# Altium schematic sheet CPU-board-Sheet2-multi-rev.0.1.SchDoc: SMART METER Main Board
size A3; SheetNumber: 2
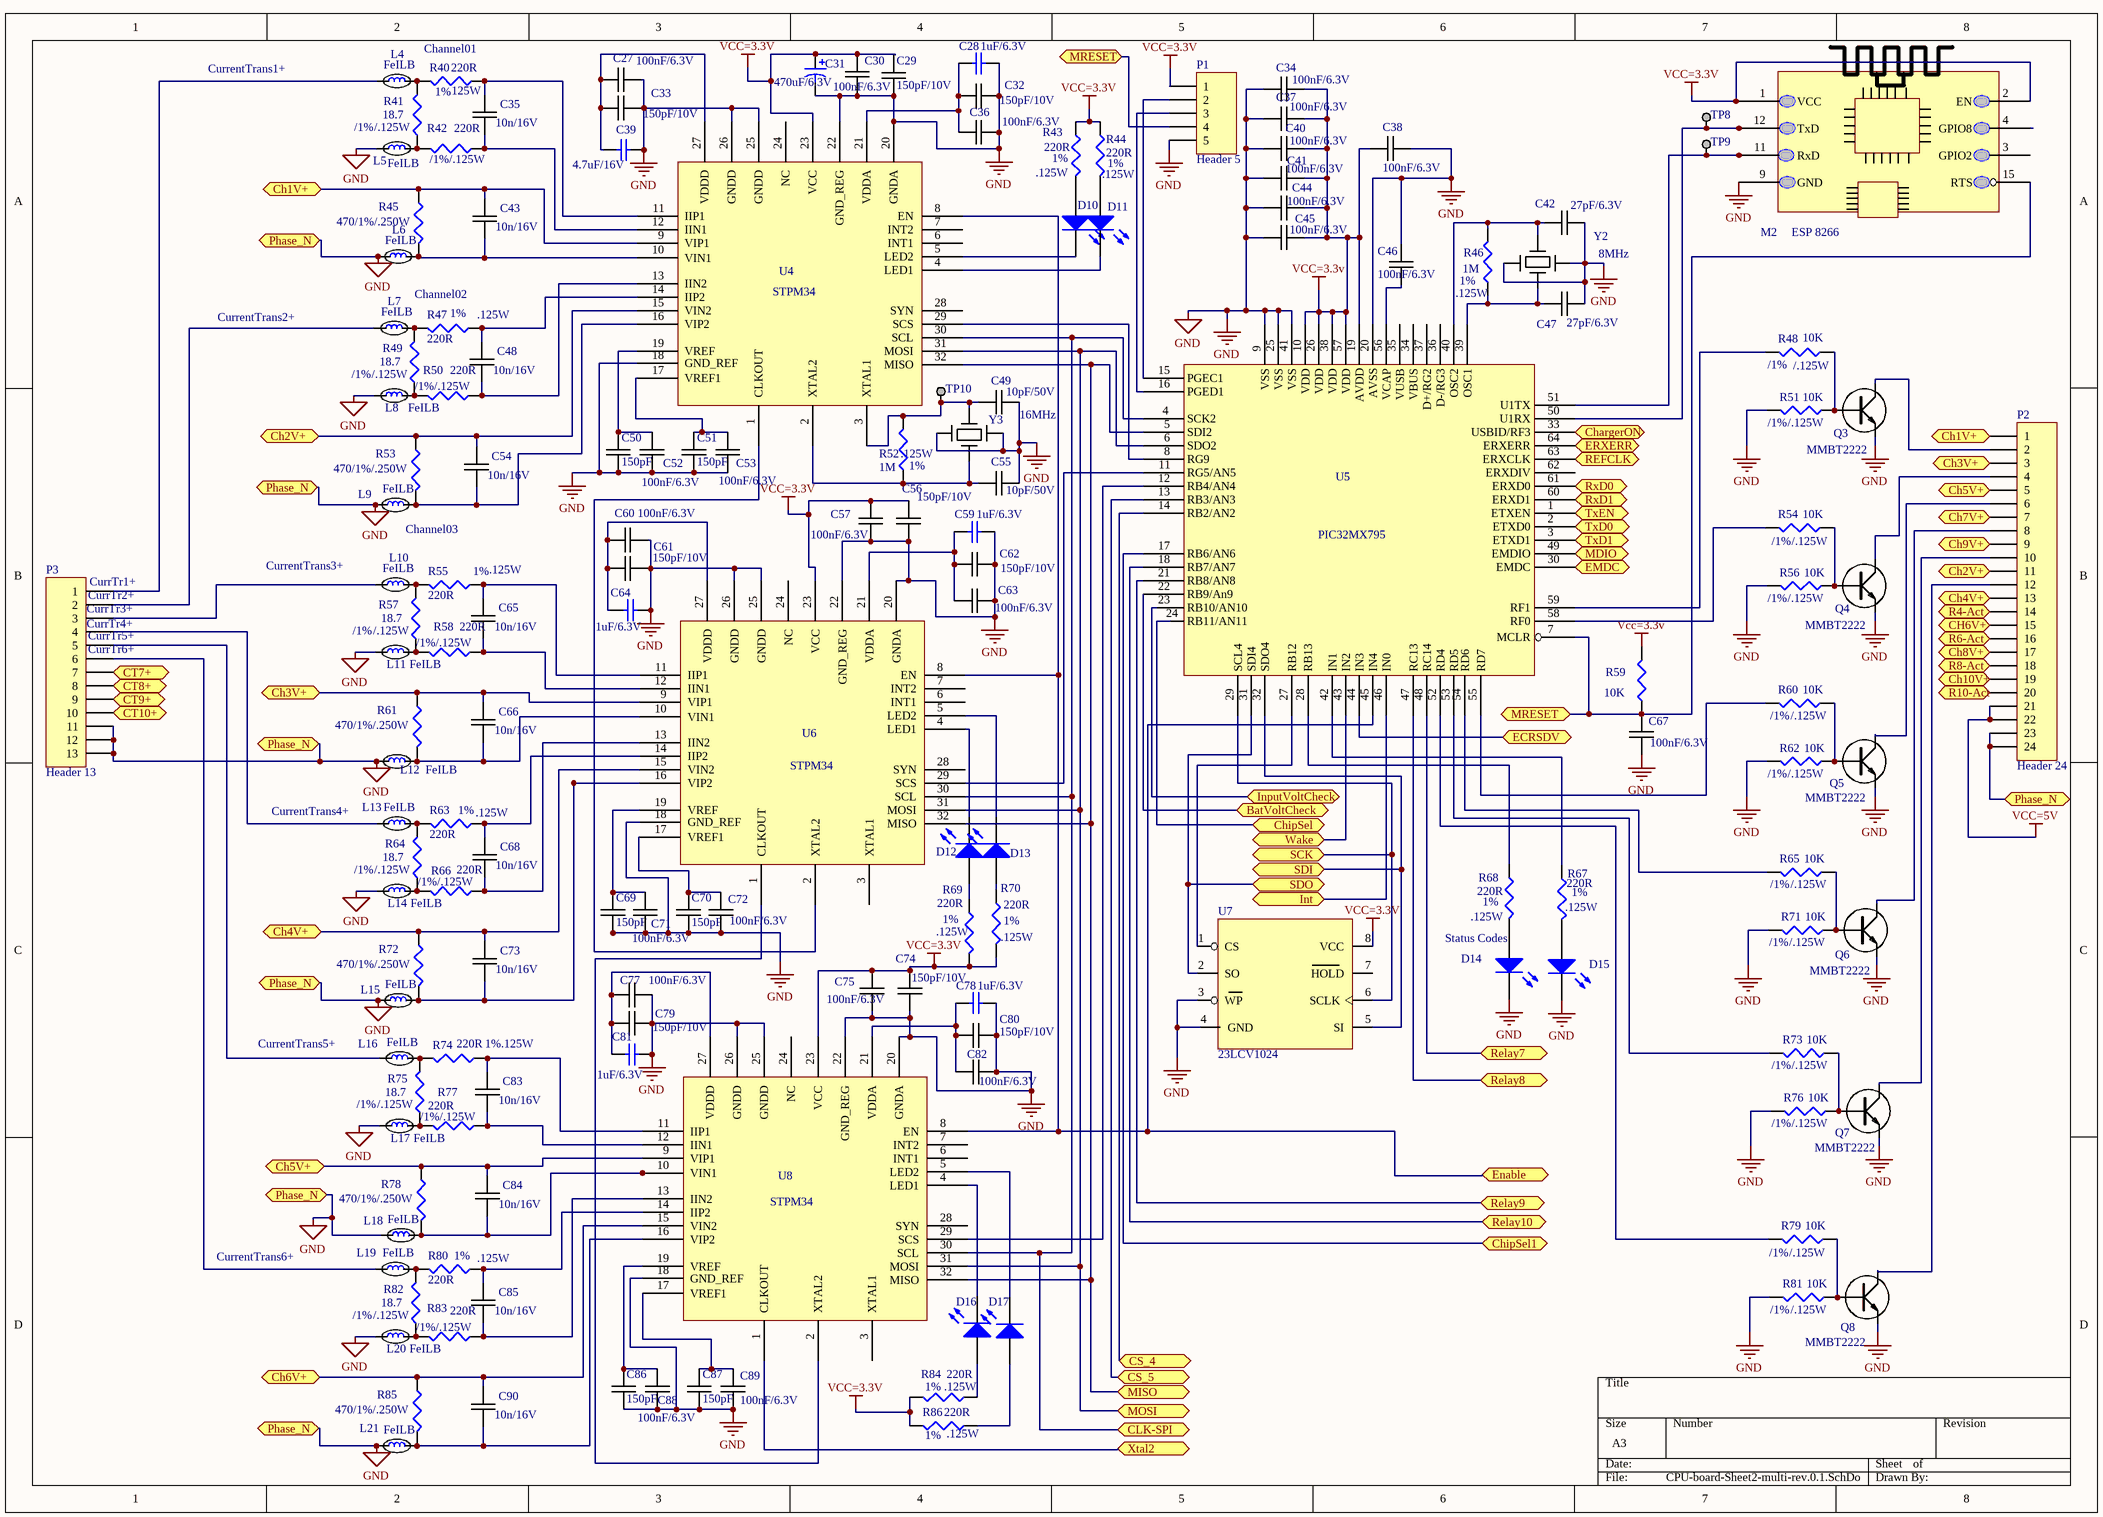
[diagram p0: CPU-board-Sheet2-multi-rev.0.1.SchDoc]

## Parts
C27  100nF/6.3V  [0402C-GENERIC]
C28  1uF/6.3V  [0402C-GENERIC]
C29  150pF/10V  [0402C-GENERIC]
C30  100nF/6.3V  [0402C-GENERIC]
C31  470uF/6.3V  [470uF/6.3v]
C32  150pF/10V  [0402C-GENERIC]
C33  150pF/10V  [0402C-GENERIC]
C34  100nF/6.3V  [0402C-GENERIC]
C35  10n/16V  [0402C-GENERIC]
C36  100nF/6.3V  [0402C-GENERIC]
C37  100nF/6.3V  [0402C-GENERIC]
C38  100nF/6.3V  [0402C-GENERIC]
C39  4.7uF/16V  [0402C-GENERIC]
C40  100nF/6.3V  [0402C-GENERIC]
C41  100nF/6.3V  [0402C-GENERIC]
C42  27pF/6.3V  [0402C-GENERIC]
C43  10n/16V  [0402C-GENERIC]
C44  100nF/6.3V  [0402C-GENERIC]
C45  100nF/6.3V  [0402C-GENERIC]
C46  100nF/6.3V  [0402C-GENERIC]
C47  27pF/6.3V  [0402C-GENERIC]
C48  10n/16V  [0402C-GENERIC]
C49  10pF/50V  [0402C-GENERIC]
C50  150pF  [0402C-GENERIC]
C51  150pF  [0402C-GENERIC]
C52  100nF/6.3V  [0402C-GENERIC]
C53  100nF/6.3V  [0402C-GENERIC]
C54  10n/16V  [0402C-GENERIC]
C55  10pF/50V  [0402C-GENERIC]
C56  150pF/10V  [0402C-GENERIC]
C57  100nF/6.3V  [0402C-GENERIC]
C59  1uF/6.3V  [0402C-GENERIC]
C60  100nF/6.3V  [0402C-GENERIC]
C61  150pF/10V  [0402C-GENERIC]
C62  150pF/10V  [0402C-GENERIC]
C63  100nF/6.3V  [0402C-GENERIC]
C64  1uF/6.3V  [0402C-GENERIC]
C65  10n/16V  [0402C-GENERIC]
C66  10n/16V  [0402C-GENERIC]
C67  100nF/6.3V  [0402C-GENERIC]
C68  10n/16V  [0402C-GENERIC]
C69  150pF  [0402C-GENERIC]
C70  150pF  [0402C-GENERIC]
C71  100nF/6.3V  [0402C-GENERIC]
C72  100nF/6.3V  [0402C-GENERIC]
C73  10n/16V  [0402C-GENERIC]
C74  150pF/10V  [0402C-GENERIC]
C75  100nF/6.3V  [0402C-GENERIC]
C77  100nF/6.3V  [0402C-GENERIC]
C78  1uF/6.3V  [0402C-GENERIC]
C79  150pF/10V  [0402C-GENERIC]
C80  150pF/10V  [0402C-GENERIC]
C81  1uF/6.3V  [0402C-GENERIC]
C82  100nF/6.3V  [0402C-GENERIC]
C83  10n/16V  [0402C-GENERIC]
C84  10n/16V  [0402C-GENERIC]
C85  10n/16V  [0402C-GENERIC]
C86  150pF  [0402C-GENERIC]
C87  150pF  [0402C-GENERIC]
C88  100nF/6.3V  [0402C-GENERIC]
C89  100nF/6.3V  [0402C-GENERIC]
C90  10n/16V  [0402C-GENERIC]
D10  LED2  [LED-SM]  (value not drawn)
D11  LED2  [LED-SM]  (value not drawn)
D12  LED2  [LED-SM]  (value not drawn)
D13  LED2  [LED-SM]  (value not drawn)
D14  LED2  [LED-SM]  (value not drawn)
D15  LED2  [LED-SM]  (value not drawn)
D16  LED2  [LED-SM]  (value not drawn)
D17  LED2  [LED-SM]  (value not drawn)
L4  FeILB  [0603C-TBD]
L5  FeILB  [0603C-TBD]
L6  FeILB  [0603C-TBD]
L7  FeILB  [0603C-TBD]
L8  FeILB  [0603C-TBD]
L9  FeILB  [0603C-TBD]
L10  FeILB  [0603C-TBD]
L11  FeILB  [0603C-TBD]
L12  FeILB  [0603C-TBD]
L13  FeILB  [0603C-TBD]
L14  FeILB  [0603C-TBD]
L15  FeILB  [0603C-TBD]
L16  FeILB  [0603C-TBD]
L17  FeILB  [0603C-TBD]
L18  FeILB  [0603C-TBD]
L19  FeILB  [0603C-TBD]
L20  FeILB  [0603C-TBD]
L21  FeILB  [0603C-TBD]
M2  ESP 8266  [PCBComponent_1 - duplicate]
P1  Header 5  [HDR1X5]
P2  Header 24  [HDR1X24]
P3  Header 13  [HDR1X13]
Q3  MMBT2222  [MMBT2222]
Q4  MMBT2222  [MMBT2222]
Q5  MMBT2222  [MMBT2222]
Q6  MMBT2222  [MMBT2222]
Q7  MMBT2222  [MMBT2222]
Q8  MMBT2222  [MMBT2222]
R40  220R  [0402R-TBD]
R41  18.7  [0402R-TBD]
R42  220R  [0402R-TBD]
R43  220R  [0402R-TBD]
R44  220R  [0402R-TBD]
R45  470/1%/.250W  [1206FB-GENERIC]
R46  1M  [0402R-TBD]
R47  220R  [0402R-TBD]
R48  10K  [0402R-TBD]
R49  18.7  [0402R-TBD]
R50  220R  [0402R-TBD]
R51  10K  [0402R-TBD]
R52  1M  [0402R-TBD]
R53  470/1%/.250W  [1206FB-GENERIC]
R54  10K  [0402R-TBD]
R55  220R  [0402R-TBD]
R56  10K  [0402R-TBD]
R57  18.7  [0402R-TBD]
R58  220R  [0402R-TBD]
R59  10K  [0402R-TBD]
R60  10K  [0402R-TBD]
R61  470/1%/.250W  [1206FB-GENERIC]
R62  10K  [0402R-TBD]
R63  220R  [0402R-TBD]
R64  18.7  [0402R-TBD]
R65  10K  [0402R-TBD]
R66  220R  [0402R-TBD]
R67  220R  [0402R-TBD]
R68  220R  [0402R-TBD]
R69  220R  [0402R-TBD]
R70  220R  [0402R-TBD]
R71  10K  [0402R-TBD]
R72  470/1%/.250W  [1206FB-GENERIC]
R73  10K  [0402R-TBD]
R74  220R  [0402R-TBD]
R75  18.7  [0402R-TBD]
R76  10K  [0402R-TBD]
R77  220R  [0402R-TBD]
R78  470/1%/.250W  [1206FB-GENERIC]
R79  10K  [0402R-TBD]
R80  220R  [0402R-TBD]
R81  10K  [0402R-TBD]
R82  18.7  [0402R-TBD]
R83  220R  [0402R-TBD]
R84  220R  [0402R-TBD]
R85  470/1%/.250W  [1206FB-GENERIC]
R86  220R  [0402R-TBD]
TP8  TESTPOINT  [TESTPOINT]  (value not drawn)
TP9  TESTPOINT  [TESTPOINT]  (value not drawn)
TP10  TESTPOINT  [TESTPOINT]  (value not drawn)
U4  STPM34  [QFN32_L]
U5  PIC32MX795  [TQFP-PT64_N]
U6  STPM34  [QFN32_L]
U7  23LCV1024  [SO8_L]
U8  STPM34  [QFN32_L]
Y2  8MHz  [CeramicResonator8-16MHZ]
Y3  16MHz  [CeramicResonator8-16MHZ]

## Ports
BatVoltCheck, Ch1V+, Ch2V+, Ch3V+, Ch4V+, Ch5V+, Ch6V+, CH6V+, Ch7V+, Ch8V+, Ch9V+, Ch10V+, ChargerON, ChipSel, ChipSel1, CLK-SPI, CS_4, CS_5, CT7+, CT8+, CT9+, CT10+, ECRSDV, EMDC, Enable, ERXERR, InputVoltCheck, Int, MDIO, MISO, MOSI, MRESET, Phase_N, R4-Act, R6-Act, R8-Act, R10-Act, REFCLK, Relay7, Relay8, Relay9, Relay10, RxD0, RxD1, SCK, SDI, SDO, TxD0, TxD1, TxEN, Wake, Xtal2

## Nets
GND: C27.2 C28.2 C29.2 C30.2 C31.2 C32.2 C33.2 C34.1 C36.2 C37.1 C38.2 C39.2 C40.1 C41.1 C42.2 C44.1 C45.1 C46.2 C47.2 C49.2 C50.2 C51.2 C52.1 C53.2 C55.2 C56.2 C57.2 C59.2 C60.2 C61.2 C62.2 C63.2 C64.2 C67.2 C69.2 C70.2 C71.2 C72.2 C74.2 C75.2 C77.2 C78.2 C79.2 C80.2 C81.2 C82.2 C86.2 C87.2 C88.2 C89.2 D14.2(K) D15.2(K) L5.1 L6.1 L8.1 L9.1 L11.1 L12.1 L14.1 L15.1 L17.1 L18.1 L20.1 L21.1 M2.9(GND) P1.5 P2.23 P2.24 P3.11 P3.12 P3.13 Q3.E Q4.E Q5.E Q6.E Q7.E Q8.E R51.2 R56.2 R62.2 R71.2 R76.2 R81.2 U4.18(GND_REF) U4.20(GNDA) U4.22(GND_REG) U4.25(GNDD) U4.26(GNDD) U5.9(VSS) U5.20(AVSS) U5.25(VSS) U5.41(VSS) U6.18(GND_REF) U6.20(GNDA) U6.22(GND_REG) U6.25(GNDD) U6.26(GNDD) U7.3(WP) U7.4(GND) U8.18(GND_REF) U8.20(GNDA) U8.22(GND_REG) U8.25(GNDD) U8.26(GNDD) Y2.2 Y2.4 Y3.2 Y3.4 ; port Phase_N
VCC=3.3V: C30.1 C31.1 C34.2 C37.2 C38.1 C40.2 C41.2 C44.2 C45.2 C56.1 C57.1 C74.1 C75.1 M2.1(VCC) M2.2(EN) P1.1 R43.1 R44.1 R59.2 R69.2 R70.2 R84.2 R86.2 U4.23(VCC) U5.10(VDD) U5.19(AVDD) U5.26(VDD) U5.38(VDD) U5.57(VDD) U6.23(VCC) U7.8(VCC) U8.23(VCC)
VCC=5V: P2.21 P2.22
BatVoltCheck: U5.22(RB9/An9) ; port BatVoltCheck
Ch1V+: C43.2 P2.1 R45.1 U4.9(VIP1) ; port Ch1V+
Ch2V+: C54.2 P2.11 R53.1 U4.15(VIN2) ; port Ch2V+
Ch3V+: C66.2 P2.3 R61.1 U6.9(VIP1) ; port Ch3V+
Ch4V+: C73.2 P2.13 R72.1 U6.15(VIN2) ; port Ch4V+
Ch5V+: C84.2 P2.5 R78.1 U8.9(VIP1) ; port Ch5V+
Ch6V+: C90.2 P2.15 R85.1 U8.15(VIN2) ; port Ch6V+, port CH6V+
Ch7V+: P2.7 ; port Ch7V+
Ch8V+: P2.17 ; port Ch8V+
Ch9V+: P2.9 ; port Ch9V+
Ch10V+: P2.19 ; port Ch10V+
ChargerON: U5.33(USBID/RF3) ; port ChargerON
ChipSel: U5.24(RB11/AN11) ; port ChipSel
ChipSel1: U5.17(RB6/AN6) ; port ChipSel1
CLK-SPI: U4.30(SCL) U5.4(SCK2) U6.30(SCL) U8.30(SCL) ; port CLK-SPI
CS_4: U5.14(RB2/AN2) ; port CS_4
CS_5: U5.13(RB3/AN3) ; port CS_5
CT7+: P3.7 ; port CT7+
CT8+: P3.8 ; port CT8+
CT9+: P3.9 ; port CT9+
CT10+: P3.10 ; port CT10+
ECRSDV: U5.44(IN3) ; port ECRSDV
EMDC: U5.30(EMDC) ; port EMDC
Enable: U4.8(EN) U5.45(IN4) U6.8(EN) U8.8(EN) ; port Enable
ERXERR: U5.64(ERXERR) ; port ERXERR
InputVoltCheck: U5.23(RB10/AN10) ; port InputVoltCheck
Int: U5.46(IN0) ; port Int
MDIO: U5.49(EMDIO) ; port MDIO
MISO: U4.32(MISO) U5.5(SDI2) U6.32(MISO) U8.32(MISO) ; port MISO
MOSI: U4.31(MOSI) U5.6(SDO2) U6.31(MOSI) U8.31(MOSI) ; port MOSI
MRESET: C67.1 M2.15(RTS) P1.4 R59.1 U5.7(MCLR) ; port MRESET
R4-Act: P2.14 ; port R4-Act
R6-Act: P2.16 ; port R6-Act
R8-Act: P2.18 ; port R8-Act
R10-Act: P2.20 ; port R10-Act
REFCLK: U5.63(ERXCLK) ; port REFCLK
Relay7: U5.48(RC14) ; port Relay7
Relay8: U5.47(RC13) ; port Relay8
Relay9: U5.21(RB8/AN8) ; port Relay9
Relay10: U5.18(RB7/AN7) ; port Relay10
RxD0: U5.61(ERXD0) ; port RxD0
RxD1: U5.60(ERXD1) ; port RxD1
SCK: U5.29(SCL4) U7.6(SCLK) ; port SCK
SDI: U5.32(SDO4) U7.5(SI) ; port SDI
SDO: U5.31(SDI4) U7.2(SO) ; port SDO
TxD0: U5.2(ETXD0) ; port TxD0
TxD1: U5.3(ETXD1) ; port TxD1
TxEN: U5.1(ETXEN) ; port TxEN
Wake: U5.43(IN2) ; port Wake
Xtal2: U8.1(CLKOUT) ; port Xtal2
NetC27_1: C27.1 C33.1 C39.1 U4.27(VDDD)
NetC28_1: C28.1 C32.1 C36.1 U4.21(VDDA)
NetC35_1: C35.1 R42.1 U4.12(IIN1)
NetC35_2: C35.2 R40.1 U4.11(IIP1)
NetC42_1: C42.1 R46.2 U5.40(OSC2) Y2.1
NetC43_1: C43.1 L6.2 R45.2 U4.10(VIN1)
NetC46_1: C46.1 U5.56(VCAP)
NetC47_1: C47.1 R46.1 U5.39(OSC1) Y2.3
NetC48_1: C48.1 R50.1 U4.13(IIN2)
NetC48_2: C48.2 R47.1 U4.14(IIP2)
NetC49_1: C49.1 R52.2 TP10.1 U4.3(XTAL1) Y3.3
NetC50_1: C50.1 C52.2 U4.19(VREF)
NetC51_1: C51.1 C53.1 U4.17(VREF1)
NetC54_1: C54.1 L9.2 R53.2 U4.16(VIP2)
NetC55_1: C55.1 R52.1 U4.2(XTAL2) Y3.1
NetC59_1: C59.1 C62.1 C63.1 U6.21(VDDA)
NetC60_1: C60.1 C61.1 C64.1 U6.27(VDDD)
NetC65_1: C65.1 R58.1 U6.12(IIN1)
NetC65_2: C65.2 R55.1 U6.11(IIP1)
NetC66_1: C66.1 L12.2 R61.2 U6.10(VIN1)
NetC68_1: C68.1 R66.1 U6.13(IIN2)
NetC68_2: C68.2 R63.1 U6.14(IIP2)
NetC69_1: C69.1 C71.1 U6.19(VREF)
NetC70_1: C70.1 C72.1 U6.17(VREF1)
NetC73_1: C73.1 L15.2 R72.2 U6.16(VIP2)
NetC77_1: C77.1 C79.1 C81.1 U8.27(VDDD)
NetC78_1: C78.1 C80.1 C82.1 U8.21(VDDA)
NetC83_1: C83.1 R77.1 U8.12(IIN1)
NetC83_2: C83.2 R74.1 U8.11(IIP1)
NetC84_1: C84.1 L18.2 R78.2 U8.10(VIN1)
NetC85_1: C85.1 R83.1 U8.13(IIN2)
NetC85_2: C85.2 R80.1 U8.14(IIP2)
NetC86_1: C86.1 C88.1 U8.19(VREF)
NetC87_1: C87.1 C89.1 U8.17(VREF1)
NetC90_1: C90.1 L21.2 R85.2 U8.16(VIP2)
NetD10_1: D10.1(A) R43.2
NetD10_2: D10.2(K) U4.5(LED2)
NetD11_1: D11.1(A) R44.2
NetD11_2: D11.2(K) U4.4(LED1)
NetD12_1: D12.1(A) R69.1
NetD12_2: D12.2(K) U6.4(LED1)
NetD13_1: D13.1(A) R70.1
NetD13_2: D13.2(K) U6.5(LED2)
NetD14_1: D14.1(A) R68.2
NetD15_1: D15.1(A) R67.2
NetD16_1: D16.1(A) R84.1
NetD16_2: D16.2(K) U8.4(LED1)
NetD17_1: D17.1(A) R86.1
NetD17_2: D17.2(K) U8.5(LED2)
NetL4_1: L4.1 P3.1
NetL4_2: L4.2 R40.2 R41.2
NetL5_2: L5.2 R41.1 R42.2
NetL7_1: L7.1 P3.2
NetL7_2: L7.2 R47.2 R49.2
NetL8_2: L8.2 R49.1 R50.2
NetL10_1: L10.1 P3.3
NetL10_2: L10.2 R55.2 R57.2
NetL11_2: L11.2 R57.1 R58.2
NetL13_1: L13.1 P3.4
NetL13_2: L13.2 R63.2 R64.2
NetL14_2: L14.2 R64.1 R66.2
NetL16_1: L16.1 P3.5
NetL16_2: L16.2 R74.2 R75.2
NetL17_2: L17.2 R75.1 R77.2
NetL19_1: L19.1 P3.6
NetL19_2: L19.2 R80.2 R82.2
NetL20_2: L20.2 R82.1 R83.2
NetM2_11: M2.11(RxD) TP9.1 U5.51(U1TX)
NetM2_12: M2.12(TxD) TP8.1 U5.50(U1RX)
NetP1_2: P1.2 U5.15(PGEC1)
NetP1_3: P1.3 U5.16(PGED1)
NetP2_2: P2.2 Q3.C
NetP2_4: P2.4 Q4.C
NetP2_6: P2.6 Q5.C
NetP2_8: P2.8 Q6.C
NetP2_10: P2.10 Q7.C
NetP2_12: P2.12 Q8.C
NetQ3_B: Q3.B R48.1 R51.1
NetQ4_B: Q4.B R54.1 R56.1
NetQ5_B: Q5.B R60.1 R62.1
NetQ6_B: Q6.B R65.1 R71.1
NetQ7_B: Q7.B R73.1 R76.1
NetQ8_B: Q8.B R79.1 R81.1
NetR48_2: R48.2 U5.59(RF1)
NetR54_2: R54.2 U5.58(RF0)
NetR60_2: R60.2 U5.55(RD7)
NetR65_2: R65.2 U5.54(RD6)
NetR67_1: R67.1 U5.42(IN1)
NetR68_1: R68.1 U5.28(RB13)
NetR73_2: R73.2 U5.53(RD5)
NetR79_2: R79.2 U5.52(RD4)
NetU4_1: U4.1(CLKOUT) U6.2(XTAL2)
NetU4_29: U4.29(SCS) U5.8(RG9)
NetU5_11: U5.11(RG5/AN5) U6.29(SCS)
NetU5_12: U5.12(RB4/AN4) U8.29(SCS)
NetU5_27: U5.27(RB12) U7.1(CS)
NetU6_1: U6.1(CLKOUT) U8.2(XTAL2)

Not connected (* = marked no-connect by the designer): C29 1; M2 3(GPIO2) 4(GPIO8); U4 6(INT1) 7(INT2) 24(NC) 28(SYN); U5 34(VBUS) 35(VUSB) 36(D-/RG3) 37(D+/RG2) 62(ERXDIV); U6 3(XTAL1) 6(INT1) 7(INT2) 24(NC) 28(SYN); U7 7(HOLD); U8 3(XTAL1) 6(INT1) 7(INT2) 24(NC) 28(SYN)

## Notes on the sheet
- Channel01
- CurrentTrans1+
- (near R40) 1%
- (near R40) .125W
- (near L5) /1%
- /.125W
- (near R42) /1%/.125W
- (near R43) .125W
- (near R43) 1%
- (near R44) .125W
- (near R44) 1%
- CurrentTrans2+
- Channel02
- (near R47) 1%
- (near R47) .125W
- (near R46) .125W
- (near R46) 1%
- (near L8) /1%
- /1%/.125W
- (near R48) /1%
- (near R48) /.125W
- (near R52) .125W
- (near R51) /1%
- (near R51) /.125W
- (near R52) 1%
- (near P3) CurrTr1+
- (near L10) CurrentTrans3+
- (near L9) Channel03
- (near R55) 1%
- (near R55) .125W
- (near R54) /1%
- (near R54) /.125W
- (near P3) CurrTr3+
- (near P3) CurrTr4+
- (near P3) CurrTr2+
- (near P3) CurrTr5+
- (near P3) CurrTr6+
- (near L11) /1%
- (near R56) /1%
- (near R56) /.125W
- (near R60) /1%
- (near R60) /.125W
- (near R62) /1%
- (near R62) /.125W
- (near L13) CurrentTrans4+
- (near R63) 1%
- (near R63) .125W
- (near L14) /1%
- (near R69) 1%
- (near R70) 1%
- (near R68) .125W
- (near R68) 1%
- (near R67) .125W
- (near R67) 1%
- (near R65) /1%
- (near R65) /.125W
- (near R69) .125W
- (near R70) .125W
- Status Codes
- (near R71) /1%
- (near R71) /.125W
- CurrentTrans5+
- (near R74) 1%
- .125W
- (near L17) /1%
- (near R76) /1%
- (near R73) /1%
- (near R76) /.125W
- (near R73) /.125W
- CurrentTrans6+
- (near R80) 1%
- (near R80) .125W
- (near R79) /1%
- (near R79) /.125W
- (near L20) /1%
- (near R81) /1%
- (near R81) /.125W
- (near R84) 1%
- (near R84) .125W
- (near R86) 1%
- (near R86) .125W

## Library data of the parts
C27 C30 C34 C36-C38 C40 C41 C44-C46 C52 C53 C57 C60 C63 C67 C71 C72 C75 C77 C82 C88 C89 = 0805C-18PF-50V-C0G-JOH: CAPACITOR 0805 CERAMIC; mfr PN: LMK105BJ104KV-F; Manufacturer: Taiyo Yuden; Mfr.PN#: CRM155R71H103KA880; Value: 100nF/16V; Suppl.PN#: 587-1227-1-ND; Supplier 1: Digi-Key; Supplier Part Number 1: 709-1171-2-ND; Package reference: 0805-TBD; Supplier: Digi-Key; PackageReference: 0402; Price: .002
C28 C59 C64 C78 C81 = Cap: Capacitor; Manufacturer: Murata; Mfr.PN#: GRM155R60J105KE19D; Value: 1uF; Suppl.PN#: 490-1320-1-ND; Published: 8-Jun-2000; LatestRevisionDate: 17-Jul-2002; LatestRevisionNote: Re-released for DXP Platform.; PackageReference: 0402; Publisher: Altium Limited; PackageDescription: Radial Cap, Thru-Hole; 2 Leads; 0.3 in Pin Spacing; Supplier: DigiKey
C29 C32 C33 C56 C61 C62 C74 C79 C80 = 0805C-18PF-50V-C0G-JOH: CAPACITOR 0805 CERAMIC; Manufacturer: Wurth Electronics; Mfr.PN#: 885012005014; Suppl.PN#: 732-7432-1-ND; Supplier 1: Digi-Key; Supplier Part Number 1: 709-1171-2-ND; Value: 150pF/10V; mfr PN: *; Supplier: Digi-Key; Price: .002
  C29 C33: PackageReference: 0402; smd: 0402
  C32: Package reference: 0805-TBD; smd: 0402
  C56 C61 C62 C74 C79 C80: Package reference: 0805-TBD; PackageReference: 0402
C31 = Cap Pol3: Polarized Capacitor (Surface Mount); Manufacturer: Nichicon; Mfr.PN#: RL80J471MDNASQKX; Value: 100uF/10v; Suppl.PN#: 493-4019-3-ND; Published: 8-Jun-2000; LatestRevisionDate: 29-May-2009; LatestRevisionNote: IPC-7351 Footprint Added.; PackageReference: Radial Can; Publisher: Altium Limited; PackageDescription: Chip Capacitor; Supplier: Digi-Key; SMD: 1206; Price: .065
C35 C43 C48 C54 C65 C66 C68 C73 C83-C85 C90 = 0805C-18PF-50V-C0G-JOH: CAPACITOR 0805 CERAMIC; Manufacturer: Murata Electronics; Mfr.PN#: GRM155R71C103KA01D; Value: 10n; Suppl.PN#: 490-1313-1-ND; Supplier 1: Digi-Key; Supplier Part Number 1: 709-1171-2-ND; mfr PN: *; PackageReference: 0402; Supplier: Digi-Key; Price: .002
  C35 C68 C73 C83-C85 C90: Suppl.PN#: GRM155R71C103KA01D; smd: 0402
  C43 C48 C54 C66: Package reference: 0402; Suppl.PN#: GRM155R71C103KA01D
  C65: Package reference: 0805-TBD
C39 = Cap: Capacitor; Manufacturer: Samsung; Mfr.PN#: CL05A475MO5NUNC; Value: 1uF; Suppl.PN#: 1276-6836-1-ND; Published: 8-Jun-2000; LatestRevisionDate: 17-Jul-2002; LatestRevisionNote: Re-released for DXP Platform.; PackageReference: 0402; Publisher: Altium Limited; PackageDescription: Radial Cap, Thru-Hole; 2 Leads; 0.3 in Pin Spacing; Supplier: DigiKey
C42 C47 = 0805C-18PF-50V-C0G-JOH: CAPACITOR 0805 CERAMIC; Manufacturer: Murata; Mfr.PN#: GRM1555C1H180JA01D; Suppliier: DigiKey; Suppl.PN#: 490-5858-1-ND; Supplier 1: Digi-Key; Supplier Part Number 1: 709-1171-2-ND; PackageReference: 0402
C49 C55 = 0805C-18PF-50V-C0G-JOH: CAPACITOR 0805 CERAMIC; Manufacturer: Murata; Mfr.PN#: GRM1555C1H100FA01D; Suppl.PN#: 490-6186-1-ND; Supplier 1: Digi-Key; Supplier Part Number 1: 709-1171-2-ND; Value: 10pF/50V; Supplier: Digi-Key; Price: .03; PackageReference: 0402
C50 C51 C69 C70 C86 C87 = 0805C-18PF-50V-C0G-JOH: CAPACITOR 0805 CERAMIC; Manufacturer: Wurth Electronics; Mfr.PN#: 885012005014; Value: 150pF/10V; Suppl.PN#: 732-7432-1-ND; Supplier 1: Digi-Key; Supplier Part Number 1: 709-1171-2-ND; mfr PN: *; Package reference: 0805-TBD; Supplier: Digi-Key; PackageReference: 0402; Price: .002
D10-D17 = LED2: Typical RED, GREEN, YELLOW, AMBER GaAs LED; Manufacturer: Lite-On Inc; Mfr.PN#: LTST-C191KGKT; Suppl.PN#: 160-1446-2-ND; Published: 8-Jun-2000; LatestRevisionDate: 17-Jul-2002; LatestRevisionNote: Re-released for DXP Platform.; PackageVersion: Feb-2002; PackageReference: 0603; Publisher: Altium Limited; PackageDescription: SM LED; 2 Flat Leads; Supplier: Digi-Key; Price: .04
L4-L21 = FerrBeads/ILBB: Manufacturer: Brand Samsung; Mfr.PN#: C1M10J152NC; Suppl.PN#: 1276-6326-1-ND; Supplier: Digi-Key; Price: .027
  L4-L7: PackageReference: 0603
M2 = ESP 8266: Suppl.PN#: ESP-WROOM-02
P1 = Header 5: Header, 5-Pin; Suppl.PN#: S9014E-05-ND; LatestRevisionDate: 17-Jul-2002; LatestRevisionNote: Re-released for DXP Platform.; Publisher: Altium Limited; Supplier: Optional depend of debugger; Supplier: Digikey
P2 = Header 24: Header, 24-Pin; Manufacturer: Guagdong, China; Mfr.PN#: PH2.54-A201; LatestRevisionDate: 17-Jul-2002; LatestRevisionNote: Re-released for DXP Platform.; Publisher: Altium Limited; Supplier: https://www.alibaba.com/product-detail/single-row-straight-24pin-female-header_925058879.html?spm=a2700.7724857.0.0.hZcBsz
P3 = Header 13: Header, 13-Pin; Manufacturer: Guangdong, China (Mainland); Mfr.PN#: EL1734164865; LatestRevisionDate: 17-Jul-2002; LatestRevisionNote: Re-released for DXP Platform.; Publisher: Altium Limited; Link access: https://www.alibaba.com/product-detail/1x40-Pin-2-54mm-Spacing-40P_60049026698.html?spm=a2700.7724838.0.0.R2zWDS
Q3-Q8 = MMBT2222: BC847 SMALL SIGNAL NPN TRANSISTOR; Manufacturer: Diodes  Inc.; Mfr.PN#: MMBT2222A-7-F; Suppl.PN#: MMBT2222A-FDICT-ND; Supplier 1: Digi-Key; Supplier Part Number 1: MMBT2222A-FDICT-ND; Supplier: Digi-Key; PackageReference: SOT23-3; Price: .03
R40 R42-R44 R47 R50 R55 R58 R63 R66-R70 R74 R77 R80 R83 R84 R86 = Res3: Resistor; Manufacturer: Panasonic; Mfr.PN#: ERJ-2RKF1001X; Value: 1K; Suppl.PN#: P1.00KLCT-ND; Published: 8-Jun-2000; LatestRevisionDate: 29-May-2009; LatestRevisionNote: IPC-7351 Footprint Added.; PackageReference: 0402; Publisher: Altium Limited; PackageDescription: Chip Resistor; Supplier: DigiKey; Price: .0035
R41 R49 R57 R64 R75 R82 = Res3: Resistor; Manufacturer: Panasonic; Mfr.PN#: ERJ-2RKF18R7X; Value: 18.7 1%; Suppl.PN#: P18.7LCT-ND; Published: 8-Jun-2000; LatestRevisionDate: 29-May-2009; LatestRevisionNote: IPC-7351 Footprint Added.; PackageReference: 0402; Publisher: Altium Limited; PackageDescription: Chip Resistor; Supplier: Digi-Key; Price: .05; SMD: 0805
R45 R53 R61 R72 R78 R85 = Res3: Resistor; Manufacturer: Panasonic Co; Mfr.PN#: ERJ-P06F6650V; Value: 470 1%/.250W; Suppl.PN#: RMCF1206FT470RDKR-ND; Published: 8-Jun-2000; LatestRevisionDate: 29-May-2009; LatestRevisionNote: IPC-7351 Footprint Added.; Publisher: Altium Limited; PackageDescription: Chip Resistor; Supplier: Digi-Key; SMD: 1206; Price: .02; PackageReference: 1206
R46 R52 = Res3: Resistor; Manufacturer: Panasonic; Mfr.PN#: ERJ-2RKF1004X; Value: 1K 1%; Suppl.PN#: P1.00MLTR-ND; Published: 8-Jun-2000; LatestRevisionDate: 29-May-2009; LatestRevisionNote: IPC-7351 Footprint Added.; PackageReference: 0402; Publisher: Altium Limited; PackageDescription: Chip Resistor; manufacture P/N: *; Supplier: Digi-Key; Price: .0027
R48 R51 R54 R56 R59 R60 R62 R65 R71 R73 R76 R79 R81 = Res3: Resistor; Manufacturer: Panasonic; Mfr.PN#: ERJ-2RKF1002X; Value: 100K; Suppl.PN#: P10.0KLTR-ND; Published: 8-Jun-2000; LatestRevisionDate: 29-May-2009; LatestRevisionNote: IPC-7351 Footprint Added.; PackageReference: 0402; Publisher: Altium Limited; PackageDescription: Chip Resistor; Supplier: Digi-Key; Price: .0035
TP8-TP10 = TESTPOINT: TESTPOINT SCOPE GRABBER; Manufacturer Part Number: 5010; Manufacturer: Keystone Electronics; Reel: TH; Supplier 1: Digi-Key; Supplier Part Number 1: 5010K-ND
U5 = PIC32MX534F064F: Manufacturer: Microchip; Mfr.PN#: PIC32MX795F512H-80I/PT; Suppl.PN#: 1778989; Supplier: Farnel; Price: 5.16; PackageReference: TQFP64N
U7 = 23LCV1024: Manufacturer: Microchip; Mfr.PN#: 23LCV1024-I/SN; Suppl.PN#: 23LCV1024-I/SN-ND; Supplier: DigiKey; PackageReference: 8-SOIC
Y2 = 12MC-HC49US-7MM: 12MHz CRYSTAL HC49US SHORT BODY; Manufacturer: KDS DAISHINKU.Corp; Mfr.PN#: DSX321G-8MHz; Supplier 1: Mouser; Supplier Part Number 1: 520-120-20-3XT
Y3 = 12MC-HC49US-7MM: 12MHz CRYSTAL HC49US SHORT BODY; Manufacturer: KDS DAIISHINKU.Corp; Mfr.PN#: DSX321SH-16MHz; Supplier 1: Mouser; Supplier Part Number 1: 520-120-20-3XT